# Altium schematic sheet devkit-visao.SchDoc
size A4; DocumentNumber: 6; SheetNumber: 6; SheetTotal: 6
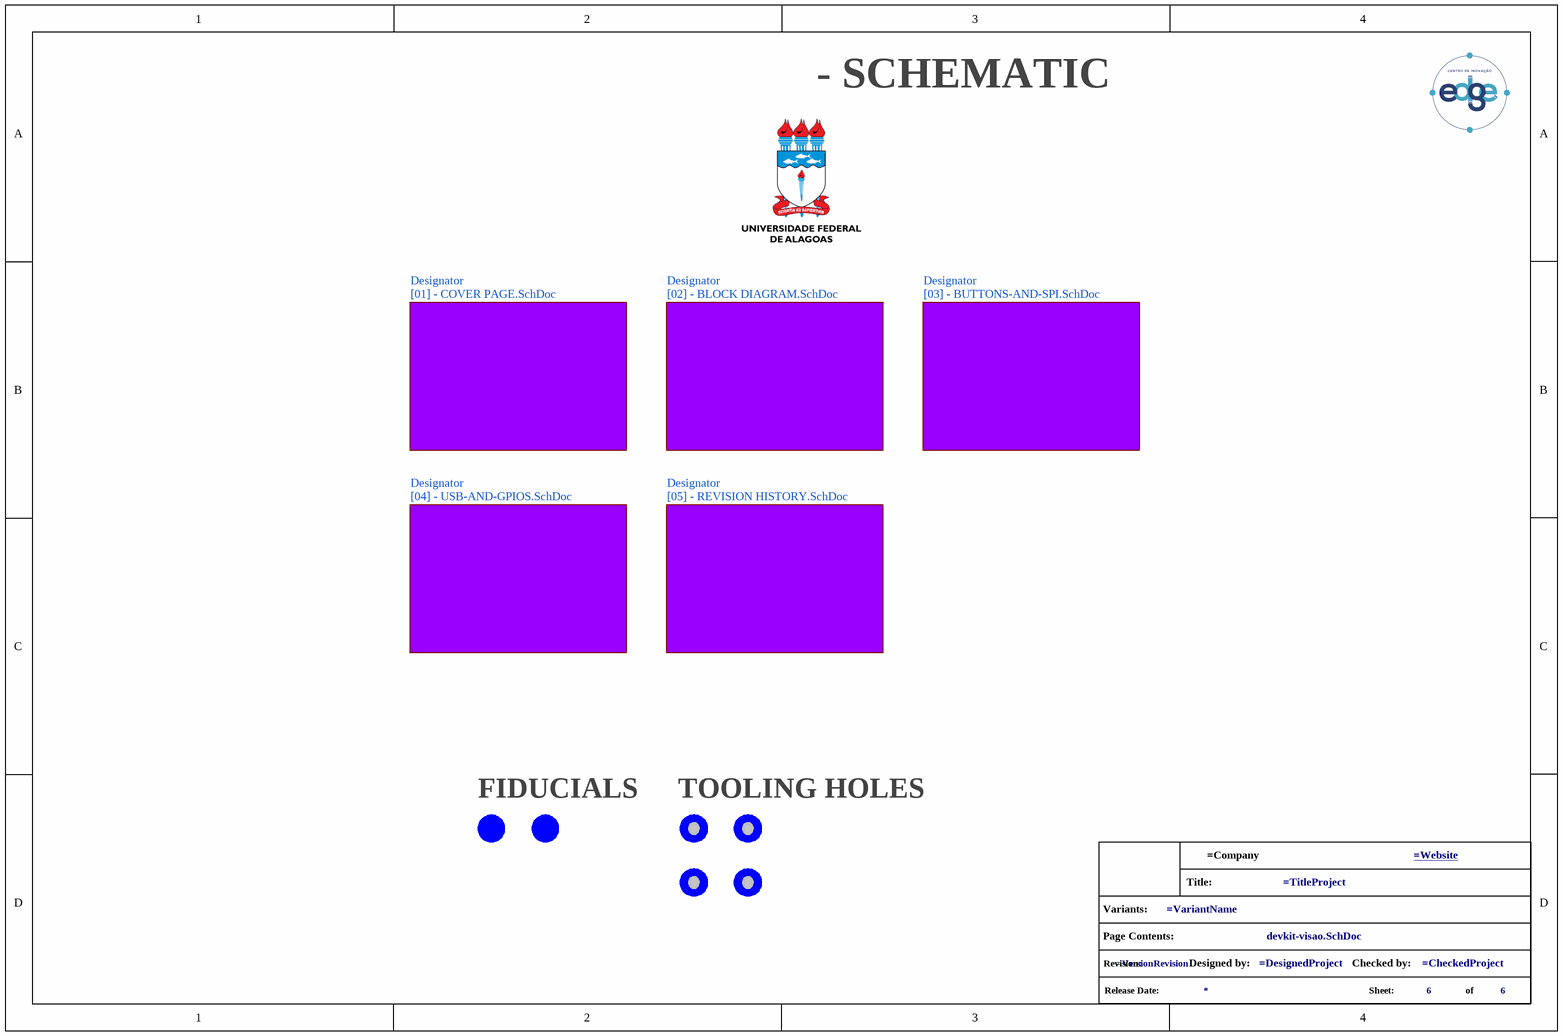
[diagram p0: devkit-visao.SchDoc]

## Parts
*?  info_project  (value not drawn)  (graphical)
FID1  FID_40X1.20  [FID_40X1.20]  (value not drawn)  (no BOM)
FID2  FID_40X1.20  [FID_40X1.20]  (value not drawn)  (no BOM)
TH1  Tooling Hole  [Tooling Hole]  (value not drawn)  (no BOM)
TH2  Tooling Hole  [Tooling Hole]  (value not drawn)  (no BOM)
TH3  Tooling Hole  [Tooling Hole]  (value not drawn)  (no BOM)
TH4  Tooling Hole  [Tooling Hole]  (value not drawn)  (no BOM)

## Sub-sheets
Designator = [02] - BLOCK DIAGRAM.SchDoc: no entries
Designator = [01] - COVER PAGE.SchDoc: no entries
Designator = [04] - USB-AND-GPIOS.SchDoc: no entries
Designator = [05] - REVISION HISTORY.SchDoc: no entries
Designator = [03] - BUTTONS-AND-SPI.SchDoc: no entries

## Notes on the sheet
- - SCHEMATIC
- FIDUCIALS
- TOOLING HOLES
- (in symbol info_project) Title:; Variants:; Page Contents:; Revision:; Designed by:; Checked by:; Release Date:; Sheet:; of

## Library data of the parts
*? = info_project: GRAPHICAL - Info Project
FID1 FID2 = FID_40X1.20: Fiducials
TH1-TH4 = Tooling Hole: MECH - Tooling Holes